# EAGLE design Lab-FullAdder (EAGLE 7.3.0)

## Sheet 1 of 2
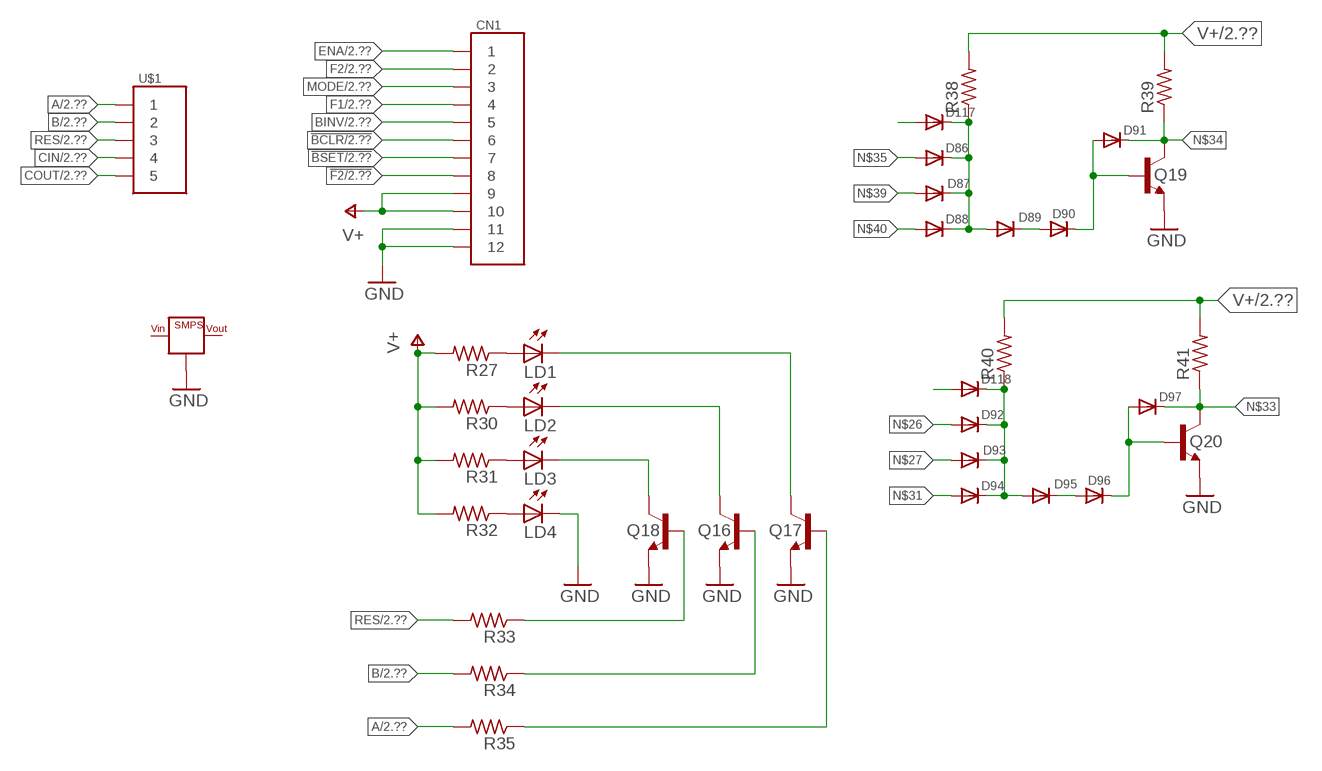
[diagram p0: schematic, sheet 1]

### Parts
CN1  HD12  [HD12]
D86  DIODE-6.3  [DO35-6.3]
D87  DIODE-6.3  [DO35-6.3]
D88  DIODE-6.3  [DO35-6.3]
D89  DIODE-6.3  [DO35-6.3]
D90  DIODE-6.3  [DO35-6.3]
D91  DIODE-7.6  [DO35-7.6]
D92  DIODE-6.3  [DO35-6.3]
D93  DIODE-6.3  [DO35-6.3]
D94  DIODE-6.3  [DO35-6.3]
D95  DIODE-6.3  [DO35-6.3]
D96  DIODE-6.3  [DO35-6.3]
D97  DIODE-7.6  [DO35-7.6]
D117  DIODE-6.3  [DO35-6.3]
D118  DIODE-6.3  [DO35-6.3]
LD1  LED-RA  [3MMRA]
LD2  LED-RA  [3MMRA]
LD3  LED-RA  [3MMRA]
LD4  LED-RA  [3MMRA]
Q16  2N3904-1  [TO92BH]
Q17  2N3904-1  [TO92BH]
Q18  2N3904-1  [TO92BH]
Q19  2N3904-1  [TO92BH]
Q20  2N3904-1  [TO92BH]
R27  R1/8-7.6MM  [R0125-7.6]
R30  R1/8-7.6MM  [R0125-7.6]
R31  R1/8-7.6MM  [R0125-7.6]
R32  R1/8-7.6MM  [R0125-7.6]
R33  R1/8-7.6MM  [R0125-7.6]
R34  R1/8-7.6MM  [R0125-7.6]
R35  R1/8-7.6MM  [R0125-7.6]
R38  R1/8-7.6MM  [R0125-7.6]
R39  R1/8-7.6MM  [R0125-7.6]
R40  R1/8-7.6MM  [R0125-7.6]
R41  R1/8-7.6MM  [R0125-7.6]
U$1  HD5CN  [HD5]
VR1  SMPS  [BUCK1722]

### Nets
!BCLR: CN1.P$6 ; also sheet 2
!BSET: CN1.P$7 ; also sheet 2
!F2: CN1.P$8 ; also sheet 2
A: R35.2 U$1.P$1 ; also sheet 2
B: R34.2 U$1.P$2 ; also sheet 2
BINV: CN1.P$5 ; also sheet 2
CIN: U$1.P$4 ; also sheet 2
COUT: U$1.P$5 ; also sheet 2
ENA: CN1.P$1 ; also sheet 2
F1: CN1.P$4 ; also sheet 2
F2: CN1.P$2 ; also sheet 2
GND [PWR]: CN1.P$11 CN1.P$12 LD4.C Q16.1(E) Q17.1(E) Q18.1(E) Q19.1(E) Q20.1(E) VR1.GND@1(GND) VR1.GND@2(GND) VR1.GND@3(GND) VR1.GND@4(GND) ; also sheet 2
MODE: CN1.P$3 ; also sheet 2
N$1: LD1.A R27.1
N$2: LD2.A R30.1
N$3: LD3.A R31.1
N$7: LD4.A R32.1
N$9: LD3.C Q18.3(C)
N$10: LD2.C Q16.3(C)
N$11: LD1.C Q17.3(C)
N$15: Q18.2(B) R33.1
N$17: Q16.2(B) R34.1
N$18: Q17.2(B) R35.1
N$26: D92.A
N$27: D93.A
N$31: D94.A
N$33: D97.C Q20.3(C) R41.1
N$34: D91.C Q19.3(C) R39.1
N$35: D86.A
N$39: D87.A
N$40: D88.A
N$42: D86.C D87.C D88.C D89.A D117.C R38.1
N$43: D89.C D90.A
N$47: D90.C D91.A Q19.2(B)
N$48: D92.C D93.C D94.C D95.A D118.C R40.1
N$49: D95.C D96.A
N$50: D96.C D97.A Q20.2(B)
N$88: D118.A
N$92: D117.A
RES: R33.2 U$1.P$3 ; also sheet 2
V+ [PWR]: CN1.P$9 CN1.P$10 R27.2 R30.2 R31.2 R32.2 R38.2 R39.2 R40.2 R41.2 ; also sheet 2

## Sheet 2 of 2
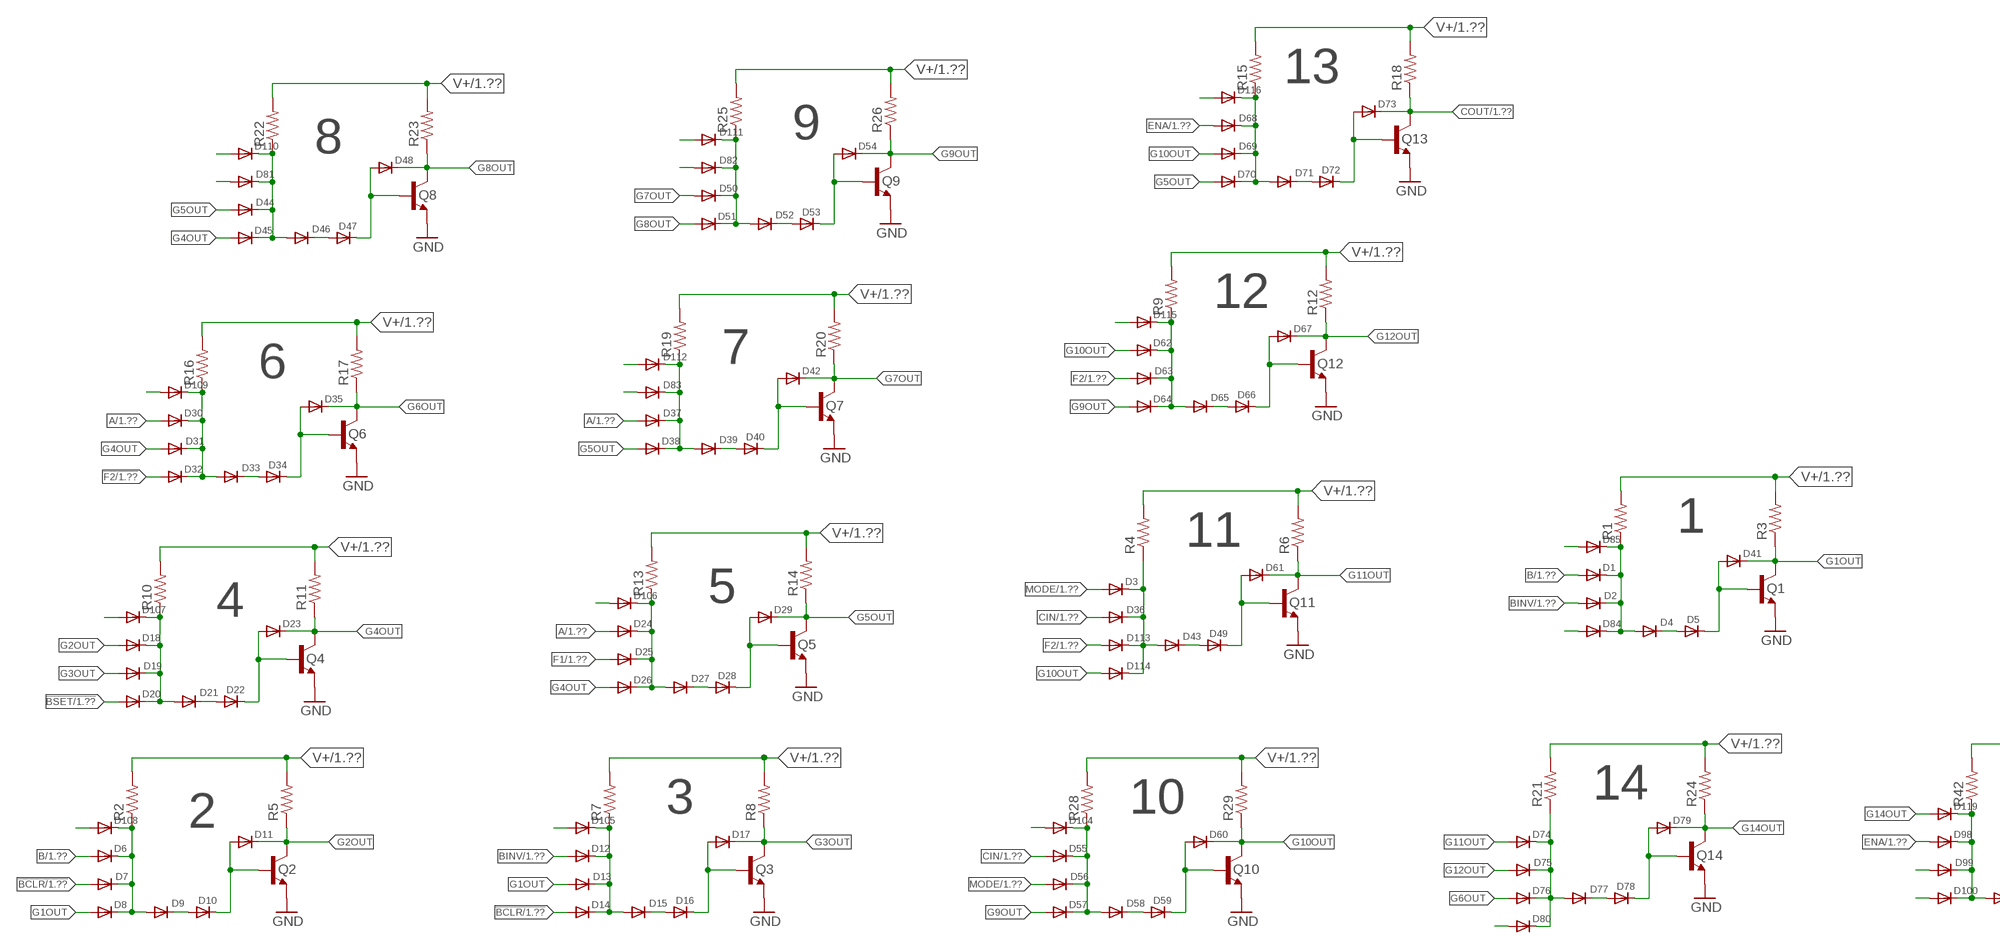
[diagram p1: schematic, sheet 2, part 1 of 2]
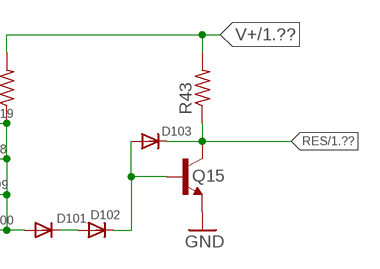
[diagram p2: schematic, sheet 2, part 2 of 2]

### Parts
D1  DIODE-6.3  [DO35-6.3]
D2  DIODE-6.3  [DO35-6.3]
D3  DIODE-6.3  [DO35-6.3]
D4  DIODE-6.3  [DO35-6.3]
D5  DIODE-6.3  [DO35-6.3]
D6  DIODE-6.3  [DO35-6.3]
D7  DIODE-6.3  [DO35-6.3]
D8  DIODE-6.3  [DO35-6.3]
D9  DIODE-6.3  [DO35-6.3]
D10  DIODE-6.3  [DO35-6.3]
D11  DIODE-7.6  [DO35-7.6]
D12  DIODE-6.3  [DO35-6.3]
D13  DIODE-6.3  [DO35-6.3]
D14  DIODE-6.3  [DO35-6.3]
D15  DIODE-6.3  [DO35-6.3]
D16  DIODE-6.3  [DO35-6.3]
D17  DIODE-7.6  [DO35-7.6]
D18  DIODE-6.3  [DO35-6.3]
D19  DIODE-6.3  [DO35-6.3]
D20  DIODE-6.3  [DO35-6.3]
D21  DIODE-6.3  [DO35-6.3]
D22  DIODE-6.3  [DO35-6.3]
D23  DIODE-7.6  [DO35-7.6]
D24  DIODE-6.3  [DO35-6.3]
D25  DIODE-6.3  [DO35-6.3]
D26  DIODE-6.3  [DO35-6.3]
D27  DIODE-6.3  [DO35-6.3]
D28  DIODE-6.3  [DO35-6.3]
D29  DIODE-7.6  [DO35-7.6]
D30  DIODE-6.3  [DO35-6.3]
D31  DIODE-6.3  [DO35-6.3]
D32  DIODE-6.3  [DO35-6.3]
D33  DIODE-6.3  [DO35-6.3]
D34  DIODE-6.3  [DO35-6.3]
D35  DIODE-7.6  [DO35-7.6]
D36  DIODE-6.3  [DO35-6.3]
D37  DIODE-6.3  [DO35-6.3]
D38  DIODE-6.3  [DO35-6.3]
D39  DIODE-6.3  [DO35-6.3]
D40  DIODE-6.3  [DO35-6.3]
D41  DIODE-7.6  [DO35-7.6]
D42  DIODE-7.6  [DO35-7.6]
D43  DIODE-6.3  [DO35-6.3]
D44  DIODE-6.3  [DO35-6.3]
D45  DIODE-6.3  [DO35-6.3]
D46  DIODE-6.3  [DO35-6.3]
D47  DIODE-6.3  [DO35-6.3]
D48  DIODE-7.6  [DO35-7.6]
D49  DIODE-6.3  [DO35-6.3]
D50  DIODE-6.3  [DO35-6.3]
D51  DIODE-6.3  [DO35-6.3]
D52  DIODE-6.3  [DO35-6.3]
D53  DIODE-6.3  [DO35-6.3]
D54  DIODE-7.6  [DO35-7.6]
D55  DIODE-6.3  [DO35-6.3]
D56  DIODE-6.3  [DO35-6.3]
D57  DIODE-6.3  [DO35-6.3]
D58  DIODE-6.3  [DO35-6.3]
D59  DIODE-6.3  [DO35-6.3]
D60  DIODE-7.6  [DO35-7.6]
D61  DIODE-7.6  [DO35-7.6]
D62  DIODE-6.3  [DO35-6.3]
D63  DIODE-6.3  [DO35-6.3]
D64  DIODE-6.3  [DO35-6.3]
D65  DIODE-6.3  [DO35-6.3]
D66  DIODE-6.3  [DO35-6.3]
D67  DIODE-7.6  [DO35-7.6]
D68  DIODE-6.3  [DO35-6.3]
D69  DIODE-6.3  [DO35-6.3]
D70  DIODE-6.3  [DO35-6.3]
D71  DIODE-6.3  [DO35-6.3]
D72  DIODE-6.3  [DO35-6.3]
D73  DIODE-7.6  [DO35-7.6]
D74  DIODE-6.3  [DO35-6.3]
D75  DIODE-6.3  [DO35-6.3]
D76  DIODE-6.3  [DO35-6.3]
D77  DIODE-6.3  [DO35-6.3]
D78  DIODE-6.3  [DO35-6.3]
D79  DIODE-7.6  [DO35-7.6]
D80  DIODE-6.3  [DO35-6.3]
D81  DIODE-6.3  [DO35-6.3]
D82  DIODE-6.3  [DO35-6.3]
D83  DIODE-6.3  [DO35-6.3]
D84  DIODE-6.3  [DO35-6.3]
D85  DIODE-6.3  [DO35-6.3]
D98  DIODE-6.3  [DO35-6.3]
D99  DIODE-6.3  [DO35-6.3]
D100  DIODE-6.3  [DO35-6.3]
D101  DIODE-6.3  [DO35-6.3]
D102  DIODE-6.3  [DO35-6.3]
D103  DIODE-7.6  [DO35-7.6]
D104  DIODE-6.3  [DO35-6.3]
D105  DIODE-6.3  [DO35-6.3]
D106  DIODE-6.3  [DO35-6.3]
D107  DIODE-6.3  [DO35-6.3]
D108  DIODE-6.3  [DO35-6.3]
D109  DIODE-6.3  [DO35-6.3]
D110  DIODE-6.3  [DO35-6.3]
D111  DIODE-6.3  [DO35-6.3]
D112  DIODE-6.3  [DO35-6.3]
D113  DIODE-6.3  [DO35-6.3]
D114  DIODE-6.3  [DO35-6.3]
D115  DIODE-6.3  [DO35-6.3]
D116  DIODE-6.3  [DO35-6.3]
D119  DIODE-6.3  [DO35-6.3]
Q1  2N3904-1  [TO92BH]
Q2  2N3904-1  [TO92BH]
Q3  2N3904-1  [TO92BH]
Q4  2N3904-1  [TO92BH]
Q5  2N3904-1  [TO92BH]
Q6  2N3904-1  [TO92BH]
Q7  2N3904-1  [TO92BH]
Q8  2N3904-1  [TO92BH]
Q9  2N3904-1  [TO92BH]
Q10  2N3904-1  [TO92BH]
Q11  2N3904-1  [TO92BH]
Q12  2N3904-1  [TO92BH]
Q13  2N3904-1  [TO92BH]
Q14  2N3904-1  [TO92BH]
Q15  2N3904-1  [TO92BH]
R1  R1/8-7.6MM  [R0125-7.6]
R2  R1/8-7.6MM  [R0125-7.6]
R3  R1/8-7.6MM  [R0125-7.6]
R4  R1/8-7.6MM  [R0125-7.6]
R5  R1/8-7.6MM  [R0125-7.6]
R6  R1/8-7.6MM  [R0125-7.6]
R7  R1/8-7.6MM  [R0125-7.6]
R8  R1/8-7.6MM  [R0125-7.6]
R9  R1/8-7.6MM  [R0125-7.6]
R10  R1/8-7.6MM  [R0125-7.6]
R11  R1/8-7.6MM  [R0125-7.6]
R12  R1/8-7.6MM  [R0125-7.6]
R13  R1/8-7.6MM  [R0125-7.6]
R14  R1/8-7.6MM  [R0125-7.6]
R15  R1/8-7.6MM  [R0125-7.6]
R16  R1/8-7.6MM  [R0125-7.6]
R17  R1/8-7.6MM  [R0125-7.6]
R18  R1/8-7.6MM  [R0125-7.6]
R19  R1/8-7.6MM  [R0125-7.6]
R20  R1/8-7.6MM  [R0125-7.6]
R21  R1/8-7.6MM  [R0125-7.6]
R22  R1/8-7.6MM  [R0125-7.6]
R23  R1/8-7.6MM  [R0125-7.6]
R24  R1/8-7.6MM  [R0125-7.6]
R25  R1/8-7.6MM  [R0125-7.6]
R26  R1/8-7.6MM  [R0125-7.6]
R28  R1/8-7.6MM  [R0125-7.6]
R29  R1/8-7.6MM  [R0125-7.6]
R42  R1/8-7.6MM  [R0125-7.6]
R43  R1/8-7.6MM  [R0125-7.6]

### Nets
!BCLR: D7.A D14.A ; also sheet 1
!BSET: D20.A ; also sheet 1
!F2: D32.A ; also sheet 1
A: D24.A D30.A D37.A ; also sheet 1
B: D1.A D6.A ; also sheet 1
BINV: D2.A D12.A ; also sheet 1
CIN: D36.A D55.A ; also sheet 1
COUT: D73.C Q13.3(C) R18.1 ; also sheet 1
ENA: D68.A D98.A ; also sheet 1
F1: D25.A ; also sheet 1
F2: D63.A D113.A ; also sheet 1
G1OUT: D8.A D13.A D41.C Q1.3(C) R3.1
G2OUT: D11.C D18.A Q2.3(C) R5.1
G3OUT: D17.C D19.A Q3.3(C) R8.1
G4OUT: D23.C D26.A D31.A D45.A Q4.3(C) R11.1
G5OUT: D29.C D38.A D44.A D70.A Q5.3(C) R14.1
G6OUT: D35.C D76.A Q6.3(C) R17.1
G7OUT: D42.C D50.A Q7.3(C) R20.1
G8OUT: D48.C D51.A Q8.3(C) R23.1
G9OUT: D54.C D57.A D64.A Q9.3(C) R26.1
G10OUT: D60.C D62.A D69.A D114.A Q10.3(C) R29.1
G11OUT: D61.C D74.A Q11.3(C) R6.1
G12OUT: D67.C D75.A Q12.3(C) R12.1
G14OUT: D79.C D119.A Q14.3(C) R24.1
GND [PWR]: Q1.1(E) Q2.1(E) Q3.1(E) Q4.1(E) Q5.1(E) Q6.1(E) Q7.1(E) Q8.1(E) Q9.1(E) Q10.1(E) Q11.1(E) Q12.1(E) Q13.1(E) Q14.1(E) Q15.1(E) ; also sheet 1
MODE: D3.A D56.A ; also sheet 1
N$4: D1.C D2.C D4.A D84.C D85.C R1.1
N$5: D4.C D5.A
N$6: D5.C D41.A Q1.2(B)
N$8: D80.A
N$12: D6.C D7.C D8.C D9.A D108.C R2.1
N$13: D9.C D10.A
N$14: D10.C D11.A Q2.2(B)
N$16: D3.C D36.C D43.A D113.C D114.C R4.1
N$20: D12.C D13.C D14.C D15.A D105.C R7.1
N$21: D15.C D16.A
N$22: D16.C D17.A Q3.2(B)
N$23: D99.A
N$24: D43.C D49.A
N$25: D100.A
N$28: D18.C D19.C D20.C D21.A D107.C R10.1
N$29: D21.C D22.A
N$30: D22.C D23.A Q4.2(B)
N$32: D49.C D61.A Q11.2(B)
N$36: D24.C D25.C D26.C D27.A D106.C R13.1
N$37: D27.C D28.A
N$38: D28.C D29.A Q5.2(B)
N$41: D81.A
N$44: D30.C D31.C D32.C D33.A D109.C R16.1
N$45: D33.C D34.A
N$46: D34.C D35.A Q6.2(B)
N$51: D98.C D99.C D100.C D101.A D119.C R42.1
N$52: D37.C D38.C D39.A D83.C D112.C R19.1
N$53: D39.C D40.A
N$54: D40.C D42.A Q7.2(B)
N$55: D101.C D102.A
N$56: D102.C D103.A Q15.2(B)
N$57: D62.C D63.C D64.C D65.A D115.C R9.1
N$58: D82.A
N$59: D83.A
N$60: D44.C D45.C D46.A D81.C D110.C R22.1
N$61: D46.C D47.A
N$62: D47.C D48.A Q8.2(B)
N$63: D85.A
N$64: D65.C D66.A
N$65: D66.C D67.A Q12.2(B)
N$66: D84.A
N$67: D104.A
N$68: D50.C D51.C D52.A D82.C D111.C R25.1
N$69: D52.C D53.A
N$70: D53.C D54.A Q9.2(B)
N$71: D105.A
N$72: D106.A
N$73: D108.A
N$74: D107.A
N$75: D109.A
N$76: D55.C D56.C D57.C D58.A D104.C R28.1
N$77: D58.C D59.A
N$78: D59.C D60.A Q10.2(B)
N$79: D110.A
N$80: D111.A
N$81: D112.A
N$82: D68.C D69.C D70.C D71.A D116.C R15.1
N$83: D71.C D72.A
N$84: D72.C D73.A Q13.2(B)
N$85: D116.A
N$86: D115.A
N$89: D74.C D75.C D76.C D77.A D80.C R21.1
N$90: D77.C D78.A
N$91: D78.C D79.A Q14.2(B)
RES: D103.C Q15.3(C) R43.1 ; also sheet 1
V+ [PWR]: R1.2 R2.2 R3.2 R4.2 R5.2 R6.2 R7.2 R8.2 R9.2 R10.2 R11.2 R12.2 R13.2 R14.2 R15.2 R16.2 R17.2 R18.2 R19.2 R20.2 R21.2 R22.2 R23.2 R24.2 R25.2 R26.2 R28.2 R29.2 R42.2 R43.2 ; also sheet 1

### Notes on the sheet
- 13
- 8 | 9
- 12
- 6 | 7
- 11 | 1
- 4 | 5
- 3 | 10 | 14
- 2

## Power pins joined to a net without a drawn wire
VIN: VR1.IN@1(VIN) VR1.IN@2(VIN)
VOUT: VR1.OUT@1(VOUT) VR1.OUT@2(VOUT)

## Library data of the parts
CN1 = SmallRoomLabs_ConSwitch:HD12
D1-D119 = SmallRoomLabs_Semiconductor:DIODE
LD1-LD4 = SmallRoomLabs_Led:LED
Q1-Q20 = SmallRoomLabs_Semiconductor:2N3904
R1-R35 R38-R43 = SmallRoomLabs_Discrete:R
U$1 = SmallRoomLabs_ConSwitch:HD5
VR1 = SmallRoomLabs_Battery:SMPS

## Net classes
0 default: width 0.305 mm, drill 0.305 mm, clearance 0.305 mm
1 PWR: width 0.203 mm, drill 0.305 mm, clearance 0.203 mm

## Board
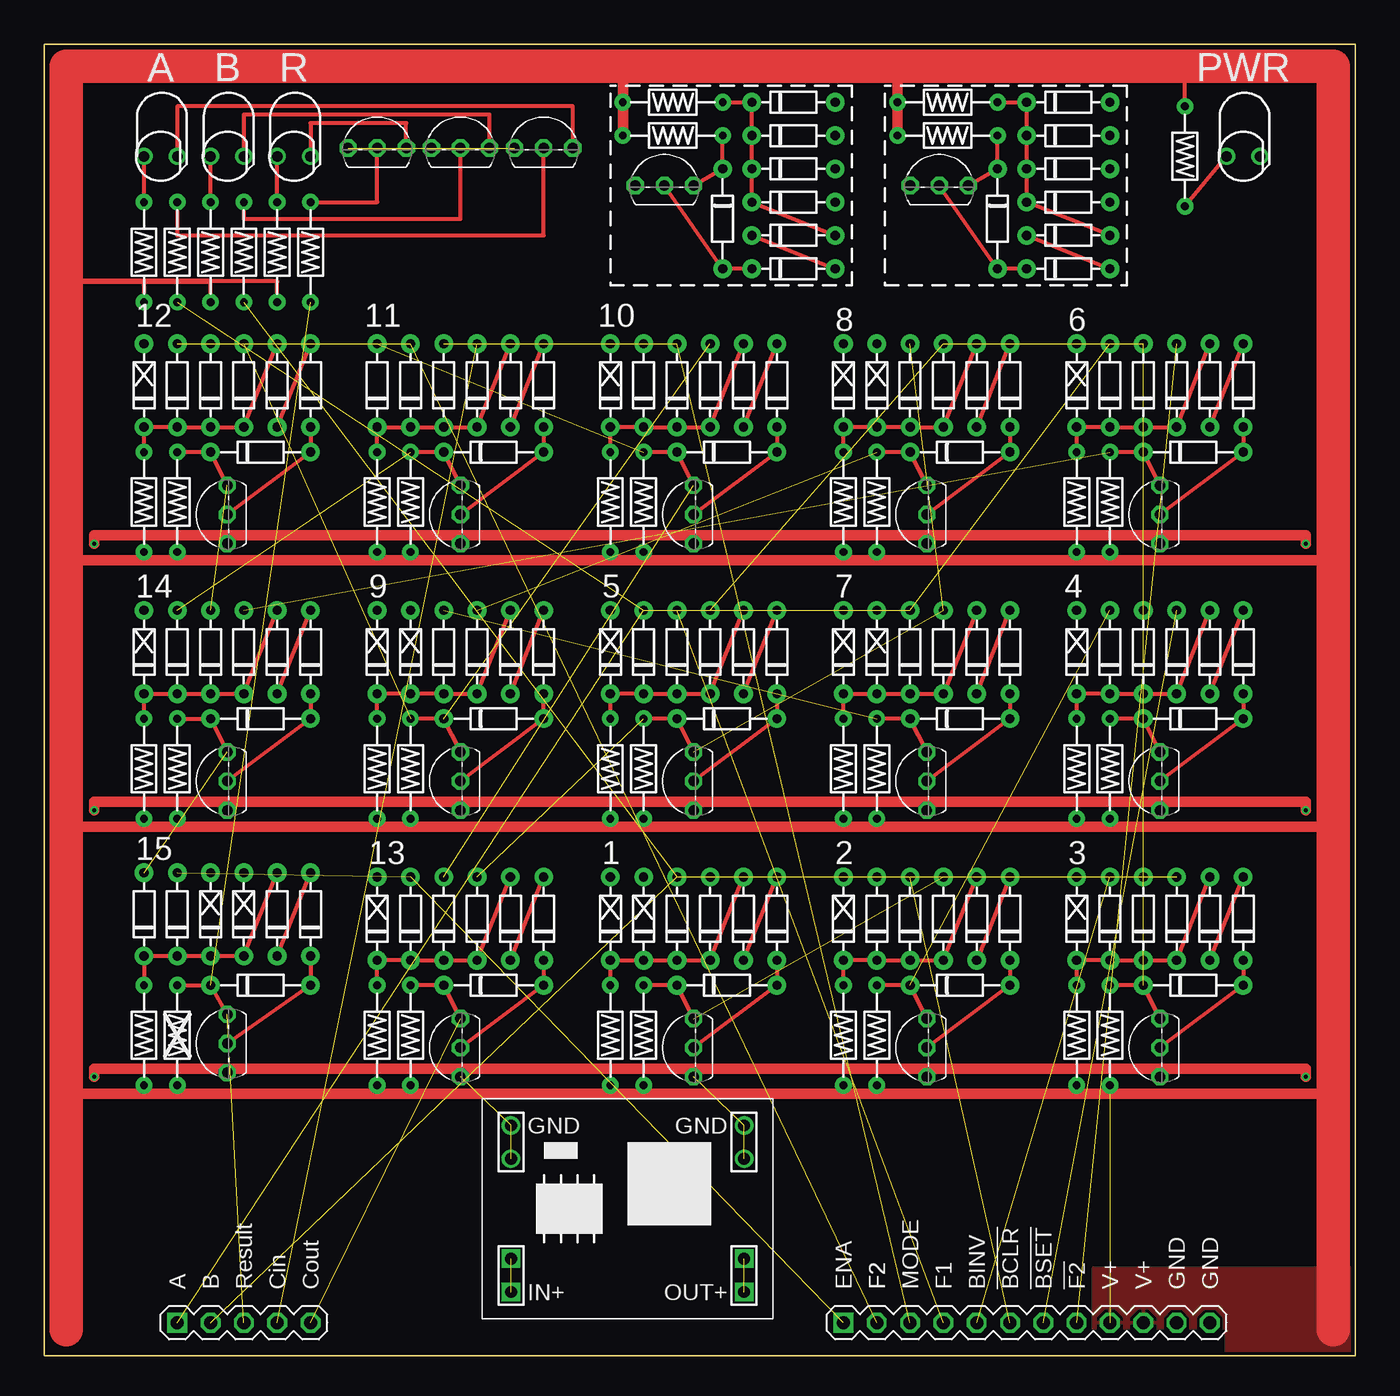
[diagram p3: board, top side]
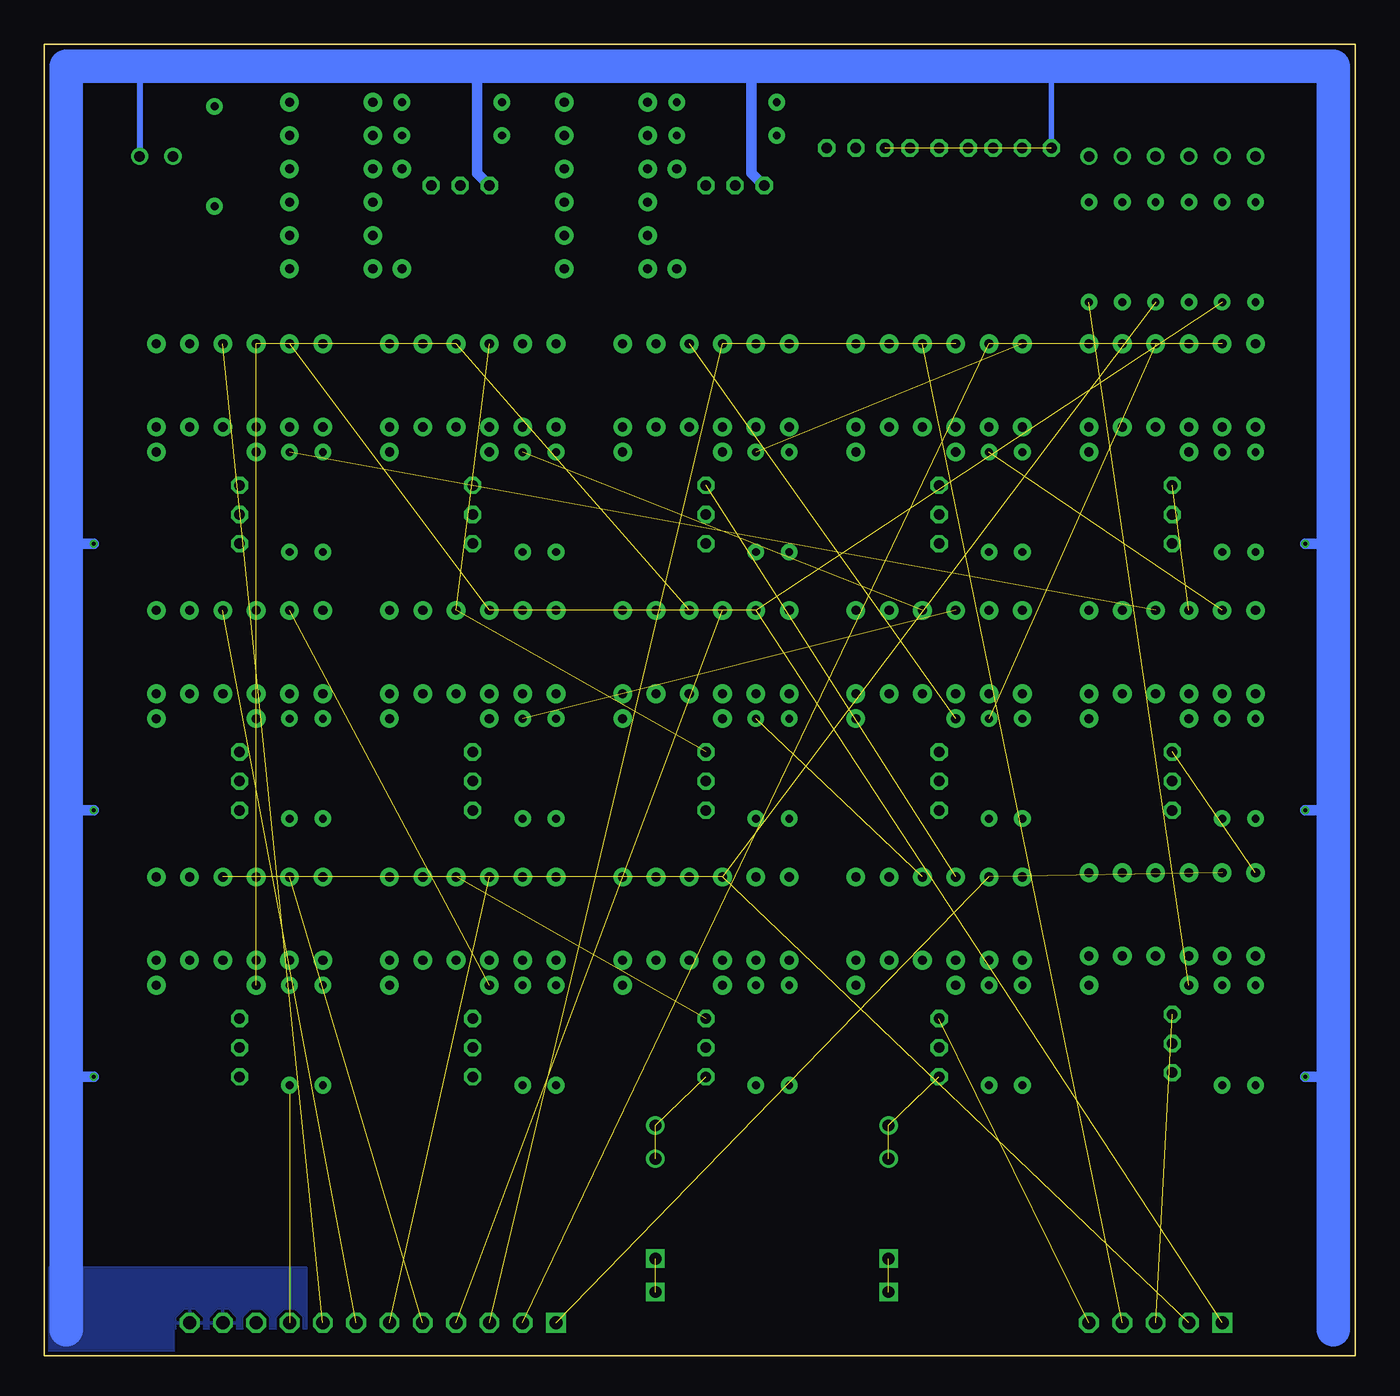
[diagram p4: board, bottom side, seen from below]

Size 100 x 100 mm. Coordinates in mm from the lower left corner, seen from the top.
Outline: 0,0 100,0 100,100 0,100 0,0
Copper layers (1*16): Top 0.035mm / dielectric 1.5mm / Bottom 0.035mm
Design rules "dirt_cheap_dirty_boards.v1": minimum track width 5mil, minimum drill 12mil, track to track 5mil, track to pad 5mil, pad to pad 5mil, via to via 5mil, smd to smd 0mil, copper to edge 10mil, drill to drill 10mil, minimum pad ring 10mil, minimum via ring 6mil, stop-mask expansion 2mil, vias tented up to drill 25mil, thermal gap 10mil
tRestrict: area 8,0 to 90,2
bRestrict: area 8,0 to 90,2

### Footprints (pad centres in the part's own frame; a part is rotated, then mirrored left to right if it is on the bottom)
HD12 = drill 1 square: P$1 -13.97,0 | drill 1 octagon: P$2 -11.43,0; P$3 -8.89,0; P$4 -6.35,0; P$5 -3.81,0; P$6 -1.27,0; P$7 1.27,0; P$8 3.81,0; P$9 6.35,0; P$10 8.89,0; P$11 11.43,0; P$12 13.97,0
DO35-6.3 = drill 0.7 pad 1.422: A -3.175,0; C 3.175,0
DO35-7.6 = drill 0.7 pad 1.422: A -3.81,0; C 3.81,0
3MMRA = drill 0.8: A -1.27,0; C 1.27,0
TO92BH = drill 0.8 octagon: 1 -2.223,0; 2 0,0; 3 2.223,0
R0125-7.6 = drill 0.6 pad 1.27: 1 -3.81,0; 2 3.81,0
HD5 = drill 1 square: P$1 -5.08,0 | drill 1 octagon: P$2 -2.54,0; P$3 0,0; P$4 2.54,0; P$5 5.08,0
BUCK1722 = drill 0.9: GND@1 -8.89,6.35; GND@2 -8.89,3.81; GND@3 8.89,6.35; GND@4 8.89,3.81 | drill 0.9 square: IN@1 -8.89,-3.81; IN@2 -8.89,-6.35; OUT@1 8.89,-3.81; OUT@2 8.89,-6.35

### Placement (x,y rotation side)
CN1  74.93,2.54 0 top
D1  48.26,33.34 270 top
D2  50.8,33.34 270 top
D3  30.48,73.98 270 top
D4  53.34,33.34 270 top
D5  55.88,33.34 270 top
D6  63.5,33.34 270 top
D7  66.04,33.34 270 top
D8  68.58,33.34 270 top
D9  71.12,33.34 270 top
D10  73.66,33.34 270 top
D11  69.85,28.26 180 top
D12  81.28,33.34 270 top
D13  83.82,33.34 270 top
D14  86.36,33.34 270 top
D15  88.9,33.34 270 top
D16  91.44,33.34 270 top
D17  87.63,28.26 180 top
D18  81.28,53.66 270 top
D19  83.82,53.66 270 top
D20  86.36,53.66 270 top
D21  88.9,53.66 270 top
D22  91.44,53.66 270 top
D23  87.63,48.58 180 top
D24  45.72,53.66 270 top
D25  48.26,53.66 270 top
D26  50.8,53.66 270 top
D27  53.34,53.66 270 top
D28  55.88,53.66 270 top
D29  52.07,48.58 180 top
D30  81.28,73.98 270 top
D31  83.82,73.98 270 top
D32  86.36,73.98 270 top
D33  88.9,73.98 270 top
D34  91.44,73.98 270 top
D35  87.63,68.9 180 top
D36  33.02,73.98 270 top
D37  66.04,53.66 270 top
D38  68.58,53.66 270 top
D39  71.12,53.66 270 top
D40  73.66,53.66 270 top
D41  52.07,28.26 180 top
D42  69.85,48.58 180 top
D43  35.56,73.98 270 top
D44  66.04,73.98 270 top
D45  68.58,73.98 270 top
D46  71.12,73.98 270 top
D47  73.66,73.98 270 top
D48  69.85,68.9 180 top
D49  38.1,73.98 270 top
D50  30.48,53.66 270 top
D51  33.02,53.66 270 top
D52  35.56,53.66 270 top
D53  38.1,53.66 270 top
D54  34.29,48.58 180 top
D55  45.72,73.98 270 top
D56  48.26,73.98 270 top
D57  50.8,73.98 270 top
D58  53.34,73.98 270 top
D59  55.88,73.98 270 top
D60  52.07,68.9 180 top
D61  34.29,68.9 180 top
D62  10.16,73.98 270 top
D63  12.7,73.98 270 top
D64  15.24,73.98 270 top
D65  17.78,73.98 270 top
D66  20.32,73.98 270 top
D67  16.51,68.9 180 top
D68  27.94,33.34 270 top
D69  30.48,33.34 270 top
D70  33.02,33.34 270 top
D71  35.56,33.34 270 top
D72  38.1,33.34 270 top
D73  34.29,28.26 180 top
D74  10.16,53.66 270 top
D75  12.7,53.66 270 top
D76  15.24,53.66 270 top
D77  17.78,53.66 270 top
D78  20.32,53.66 270 top
D79  16.51,48.58 180 top
D80  7.62,53.66 270 top
D81  63.5,73.98 270 top
D82  27.94,53.66 270 top
D83  63.5,53.66 270 top
D84  45.72,33.34 270 top
D85  43.18,33.34 270 top
D86  57.15,93.03 180 top
D87  57.15,90.49 180 top
D88  57.15,87.95 180 top
D89  57.15,85.41 180 top
D90  57.15,82.87 180 top
D91  51.75,86.68 90 top
D92  78.11,93.03 180 top
D93  78.11,90.49 180 top
D94  78.11,87.95 180 top
D95  78.11,85.41 180 top
D96  78.11,82.87 180 top
D97  72.71,86.68 90 top
D98  10.16,33.66 270 top
D99  12.7,33.66 270 top
D100  15.24,33.66 270 top
D101  17.78,33.66 270 top
D102  20.32,33.66 270 top
D103  16.51,28.26 180 top
D104  43.18,73.98 270 top
D105  78.74,33.34 270 top
D106  43.18,53.66 270 top
D107  78.74,53.66 270 top
D108  60.96,33.34 270 top
D109  78.74,73.98 270 top
D110  60.96,73.98 270 top
D111  25.4,53.66 270 top
D112  60.96,53.66 270 top
D113  27.94,73.98 270 top
D114  25.4,73.98 270 top
D115  7.62,73.98 270 top
D116  25.4,33.34 270 top
D117  57.15,95.57 180 top
D118  78.11,95.57 180 top
D119  7.62,33.66 270 top
LD1  8.89,91.44 0 top
LD2  13.97,91.44 0 top
LD3  19.05,91.44 0 top
LD4  91.44,91.44 0 top
Q1  49.53,23.5 90 top
Q2  67.31,23.5 90 top
Q3  85.09,23.5 90 top
Q4  85.09,43.81 90 top
Q5  49.53,43.81 90 top
Q6  85.09,64.14 90 top
Q7  67.31,43.81 90 top
Q8  67.31,64.14 90 top
Q9  31.75,43.81 90 top
Q10  49.53,64.14 90 top
Q11  31.75,64.14 90 top
Q12  13.97,64.14 90 top
Q13  31.75,23.5 90 top
Q14  13.97,43.81 90 top
Q15  13.97,23.81 90 top
Q16  31.75,92.08 0 top
Q17  38.1,92.08 0 top
Q18  25.4,92.08 0 top
Q19  47.31,89.22 0 top
Q20  68.26,89.22 0 top
R1  43.18,24.45 270 top
R2  60.96,24.45 270 top
R3  45.72,24.45 270 top
R4  25.4,65.09 270 top
R5  63.5,24.45 270 top
R6  27.94,65.09 270 top
R7  78.74,24.45 270 top
R8  81.28,24.45 270 top
R9  7.62,65.09 270 top
R10  78.74,44.77 270 top
R11  81.28,44.77 270 top
R12  10.16,65.09 270 top
R13  43.18,44.77 270 top
R14  45.72,44.77 270 top
R15  25.4,24.45 270 top
R16  78.74,65.09 270 top
R17  81.28,65.09 270 top
R18  27.94,24.45 270 top
R19  60.96,44.77 270 top
R20  63.5,44.77 270 top
R21  7.62,44.77 270 top
R22  60.96,65.09 270 top
R23  63.5,65.09 270 top
R24  10.16,44.77 270 top
R25  25.4,44.77 270 top
R26  27.94,44.77 270 top
R27  7.62,84.14 270 top
R28  43.18,65.09 270 top
R29  45.72,65.09 270 top
R30  12.7,84.14 270 top
R31  17.78,84.14 270 top
R32  87,91.44 90 top
R33  20.32,84.14 270 top
R34  15.24,84.14 270 top
R35  10.16,84.14 270 top
R38  47.94,95.57 180 top
R39  47.94,93.03 180 top
R40  68.9,95.57 180 top
R41  68.9,93.03 180 top
R42  7.62,24.45 270 top
R43  10.16,24.45 270 top
U$1  15.24,2.54 0 top
VR1  44.49,11.22 0 top

### Tracks (layer width: path | path; a pad name or v marks a point on that pad's centre or on a via)
!BCLR  (2 unrouted)
!BSET  (1 unrouted)
!F2  (1 unrouted)
A  (4 unrouted)
B  (3 unrouted)
BINV  (2 unrouted)
CIN  (2 unrouted)
COUT  (1 unrouted)
  Top 0.305: Q13.3 D73.C R18.1
ENA  (2 unrouted)
F1  (1 unrouted)
F2  (2 unrouted)
G1OUT  (2 unrouted)
  Top 0.305: Q1.3 D41.C R3.1
G2OUT  (1 unrouted)
  Top 0.305: Q2.3 D11.C R5.1
G3OUT  (1 unrouted)
  Top 0.305: Q3.3 D17.C R8.1
G4OUT  (3 unrouted)
  Top 0.305: Q4.3 D23.C R11.1
G5OUT  (3 unrouted)
  Top 0.305: Q5.3 D29.C R14.1
G6OUT  (1 unrouted)
  Top 0.305: Q6.3 D35.C R17.1
G7OUT  (1 unrouted)
  Top 0.305: Q7.3 D42.C R20.1
G8OUT  (1 unrouted)
  Top 0.305: Q8.3 D48.C R23.1
G9OUT  (2 unrouted)
  Top 0.305: Q9.3 D54.C R26.1
G10OUT  (3 unrouted)
  Top 0.305: Q10.3 D60.C R29.1
G11OUT  (1 unrouted)
  Top 0.305: Q11.3 D61.C R6.1
G12OUT  (1 unrouted)
  Top 0.305: Q12.3 D67.C R12.1
G14OUT  (1 unrouted)
  Top 0.305: R24.1 D79.C Q14.3
GND  (via drill 0.3)  (6 unrouted)
  Top 0.406: Q1.1 49.53,21.91
  Top 0.813: 13.97,62.55 3.81,62.55 v3.81,61.91 | 13.97,62.55 31.75,62.55 | 31.75,62.55 49.53,62.55 | 49.53,62.55 67.31,62.55 | 67.31,62.55 85.09,62.55 | 85.09,62.55 96.2,62.55 v96.2,61.91 | 13.97,42.23 3.81,42.23 v3.81,41.59 | 13.97,42.23 31.75,42.23 | 31.75,42.23 49.53,42.23 | 49.53,42.23 67.31,42.23 | 67.31,42.23 85.09,42.23 | 85.09,42.23 96.2,42.23 v96.2,41.59 | 13.97,21.91 3.81,21.91 v3.81,21.27 | 13.97,21.91 31.75,21.91 | 31.75,21.91 49.53,21.91 67.31,21.91 | 67.31,21.91 85.09,21.91 | 85.09,21.91 96.2,21.91 v96.2,21.27 | Q11.1 31.75,62.55 | Q8.1 67.31,62.55 | Q6.1 85.09,62.55 | Q12.1 13.97,62.55 | Q7.1 67.31,42.23 | Q4.1 85.09,42.23 | Q5.1 49.53,42.23 | Q9.1 31.75,42.23 | Q14.1 13.97,42.23 | Q13.1 31.75,21.91 | Q2.1 67.31,21.91 | Q3.1 85.09,21.91 | Q10.1 49.53,62.55 | Q15.1 13.97,21.91
  Bottom 0.203: LD4.C 92.56,91.44 92.56,98.32
  Bottom 0.406: LD4.C 92.71,98.42 | Q18.1 23.18,98.32
  Bottom 0.813: v96.2,61.91 98.42,61.91 | v3.81,61.91 1.68,61.91 | v3.81,41.59 1.68,41.59 | v96.2,41.59 98.42,41.59 | v3.81,21.27 1.91,21.27 | Q19.1 46.04,90.17 46.04,98.32 | Q20.1 66.99,90.17 66.99,98.32 | v96.2,21.27 98.32,21.27
  Bottom 2.54: 98.32,2 98.32,21.27 98.32,98.32 92.56,98.32 66.99,98.32 46.04,98.32 23.18,98.32 1.68,98.32 1.68,61.91 1.68,41.59 1.68,2
  pour Bottom: 80,6.68 100,6.68 100,0 80,0
MODE  (2 unrouted)
N$1
  Top 0.305: R27.1 LD1.A
N$2
  Top 0.305: R30.1 LD2.A
N$3
  Top 0.305: R31.1 LD3.A
N$4
  Top 0.305: R1.1 D85.C D84.C D1.C D2.C D4.A
N$5
  Top 0.305: D4.C D5.A
N$6
  Top 0.305: D5.C D41.A Q1.2
N$7
  Top 0.305: R32.1 LD4.A
N$9
  Top 0.305: Q18.3 27.62,93.98 20.32,93.98 LD3.C
N$10
  Top 0.305: Q16.3 33.97,94.61 15.24,94.61 LD2.C
N$11
  Top 0.305: Q17.3 40.32,95.25 10.16,95.25 LD1.C
N$12
  Top 0.305: R2.1 D108.C D6.C D7.C D8.C D9.A
N$13
  Top 0.305: D10.A D9.C
N$14
  Top 0.305: D10.C D11.A Q2.2
N$15
  Top 0.305: R33.1 25.4,87.95 Q18.2
N$16
  Top 0.305: R4.1 D114.C D113.C D3.C D36.C D43.A
N$17
  Top 0.305: R34.1 15.24,86.68 31.75,86.68 Q16.2
N$18
  Top 0.305: R35.1 10.16,85.41 38.1,85.41 Q17.2
N$20
  Top 0.305: D15.A D14.C D13.C D12.C D105.C R7.1
N$21
  Top 0.305: D15.C D16.A
N$22
  Top 0.305: Q3.2 D17.A D16.C
N$24
  Top 0.305: D43.C D49.A
N$28
  Top 0.305: R10.1 D107.C D18.C D19.C D20.C D21.A
N$29
  Top 0.305: D21.C D22.A
N$30
  Top 0.305: D22.C D23.A Q4.2
N$32
  Top 0.305: D49.C D61.A Q11.2
N$33
  Top 0.305: Q20.3 D97.C R41.1
N$34
  Top 0.305: Q19.3 D91.C R39.1
N$36
  Top 0.305: R13.1 D106.C D24.C D25.C D26.C D27.A
N$37
  Top 0.305: D27.C D28.A
N$38
  Top 0.305: Q5.2 D29.A D28.C
N$42
  Top 0.305: R38.1 D117.C D86.C D87.C D88.C D89.A
N$43
  Top 0.305: D89.C D90.A
N$44
  Top 0.305: R16.1 D109.C D30.C D31.C D32.C D33.A
N$45
  Top 0.305: D33.C D34.A
N$46
  Top 0.305: Q6.2 D35.A D34.C
N$47
  Top 0.305: D90.C D91.A Q19.2
N$48
  Top 0.305: R40.1 D118.C D92.C D93.C D94.C D95.A
N$49
  Top 0.305: D95.C D96.A
N$50
  Top 0.305: Q20.2 D97.A D96.C
N$51
  Top 0.305: D101.A D100.C D99.C D98.C D119.C R42.1
N$52
  Top 0.305: R19.1 D112.C D83.C D37.C D38.C D39.A
N$53
  Top 0.305: D39.C D40.A
N$54
  Top 0.305: D40.C D42.A Q7.2
N$55
  Top 0.305: D101.C D102.A
N$56
  Top 0.305: Q15.2 D103.A D102.C
N$57
  Top 0.305: D65.A D64.C D63.C D62.C D115.C R9.1
N$60
  Top 0.305: R22.1 D110.C D81.C D44.C D45.C D46.A
N$61
  Top 0.305: D46.C D47.A
N$62
  Top 0.305: D47.C D48.A Q8.2
N$64
  Top 0.305: D65.C D66.A
N$65
  Top 0.305: Q12.2 D67.A D66.C
N$68
  Top 0.305: R25.1 D111.C D82.C D50.C D51.C D52.A
N$69
  Top 0.305: D52.C D53.A
N$70
  Top 0.305: D53.C D54.A Q9.2
N$76
  Top 0.305: R28.1 D104.C D55.C D56.C D57.C D58.A
N$77
  Top 0.305: D58.C D59.A
N$78
  Top 0.305: D59.C D60.A Q10.2
N$82
  Top 0.305: R15.1 D116.C D68.C D69.C D70.C D71.A
N$83
  Top 0.305: D71.C D72.A
N$84
  Top 0.305: D72.C D73.A Q13.2
N$89
  Top 0.305: R21.1 D80.C D74.C D75.C D76.C D77.A
N$90
  Top 0.305: D77.C D78.A
N$91
  Top 0.305: D78.C D79.A Q14.2
RES  (2 unrouted)
  Top 0.305: R43.1 D103.C Q15.3
V+  (1 unrouted)
  Top 0.203: 80.01,98.17 80.16,98.32 | 1.27,76.83 1.68,81.6
  Top 0.305: R32.2 87,98.32 | R31.2 17.78,81.92 12.7,81.92 R30.2 | R27.2 7.62,81.92
  Top 0.406: 73.66,98.32 73.98,98.32 | 55.88,98.32 56.2,98.32 | 38.1,98.32 38.42,98.32 | 98.11,60.64 98.11,40.32 | 12.7,81.92 7.62,81.92 1.68,81.92 | R42.2 7.62,20 | R15.2 25.4,20 | R1.2 43.18,20 | R2.2 60.96,20 | R8.2 81.28,20 | R7.2 78.74,20 | R5.2 63.5,20 | R3.2 45.72,20 | R18.2 27.94,20 | R43.2 10.16,20
  Top 0.813: 1.68,60.64 7.62,60.64 | 7.62,60.64 10.16,60.64 | 10.16,60.64 25.4,60.64 | 25.4,60.64 27.94,60.64 | 27.94,60.64 43.18,60.64 | 43.18,60.64 45.72,60.64 | 45.72,60.64 60.96,60.64 | 60.96,60.64 63.5,60.64 | 63.5,60.64 78.74,60.64 | 78.74,60.64 81.28,60.64 | 81.28,60.64 98.11,60.64 | 98.11,40.32 81.28,40.32 | 81.28,40.32 78.74,40.32 | 78.74,40.32 63.5,40.32 | 63.5,40.32 60.96,40.32 | 60.96,40.32 45.72,40.32 | 45.72,40.32 43.18,40.32 | 43.18,40.32 27.94,40.32 | 27.94,40.32 25.4,40.32 | 25.4,40.32 10.16,40.32 | 10.16,40.32 7.62,40.32 | 7.62,40.32 1.27,40.32 | 98.11,20 81.28,20 78.74,20 63.5,20 60.96,20 45.72,20 43.18,20 27.94,20 25.4,20 10.16,20 7.62,20 1.59,20 | R25.2 25.4,40.32 | R26.2 27.94,40.32 | R24.2 10.16,40.32 | R21.2 7.62,40.32 | R13.2 43.18,40.32 | R14.2 45.72,40.32 | R19.2 60.96,40.32 | R20.2 63.5,40.32 | R10.2 78.74,40.32 | R11.2 81.28,40.32 | R23.2 63.5,60.64 | R22.2 60.96,60.64 | R16.2 78.74,60.64 | R17.2 81.28,60.64 | R29.2 45.72,60.64 | R28.2 43.18,60.64 | R6.2 27.94,60.64 | R4.2 25.4,60.64 | R12.2 10.16,60.64 | R9.2 7.62,60.64 | R41.2 R40.2 65.09,98.32 | R39.2 R38.2 44.13,98.32 44.45,98.32
  Top 2.54: 98.32,2 98.32,98.32 87,98.32 80.16,98.32 73.98,98.32 65.09,98.32 56.2,98.32 44.45,98.32 38.42,98.32 1.68,98.32 1.68,81.92 1.68,81.6 1.68,60.64 1.68,2
  pour Top: 80,0 100,0 100,6.68 80,6.68
VIN  (1 unrouted)
VOUT  (1 unrouted)

### Text on the board
tPlace: A | B | R | PWR | 12 | 11 | 10 | 8 | 6 | 14 | 9 | 5 | 7 | 4 | 15 | 13 | 1 | 2 | 3 | A | B | Result | Cin | Cout | ENA | F2 | F2 | MODE | F1 | BINV | !BCLR | !BSET | !F2 | V+ | V+ | GND | GND